# Altium project rp3a0_mini.PrjPcb
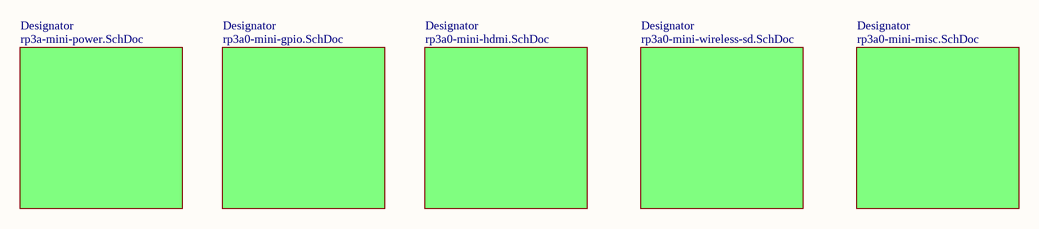
[diagram p0: rp3a0-mini-main.SchDoc]
6 sheets, 124 parts. Net scope: global (net labels, ports and power ports of the same name join across sheets).
Board file: rp3a0-mini.PcbDoc
Sheets:
  rp3a0-mini-main.SchDoc
    Designator = rp3a-mini-power.SchDoc
    Designator = rp3a0-mini-gpio.SchDoc
    Designator = rp3a0-mini-hdmi.SchDoc
    Designator = rp3a0-mini-wireless-sd.SchDoc
    Designator = rp3a0-mini-misc.SchDoc

## Sheet rp3a0-mini-main.SchDoc
size A4; SheetNumber: 1; SheetTotal: 6

### Sub-sheets
Designator = rp3a-mini-power.SchDoc: no entries
Designator = rp3a0-mini-gpio.SchDoc: no entries
Designator = rp3a0-mini-hdmi.SchDoc: no entries
Designator = rp3a0-mini-wireless-sd.SchDoc: no entries
Designator = rp3a0-mini-misc.SchDoc: no entries

## Sheet rp3a-mini-power.SchDoc
size A4; SheetNumber: 2; SheetTotal: 6
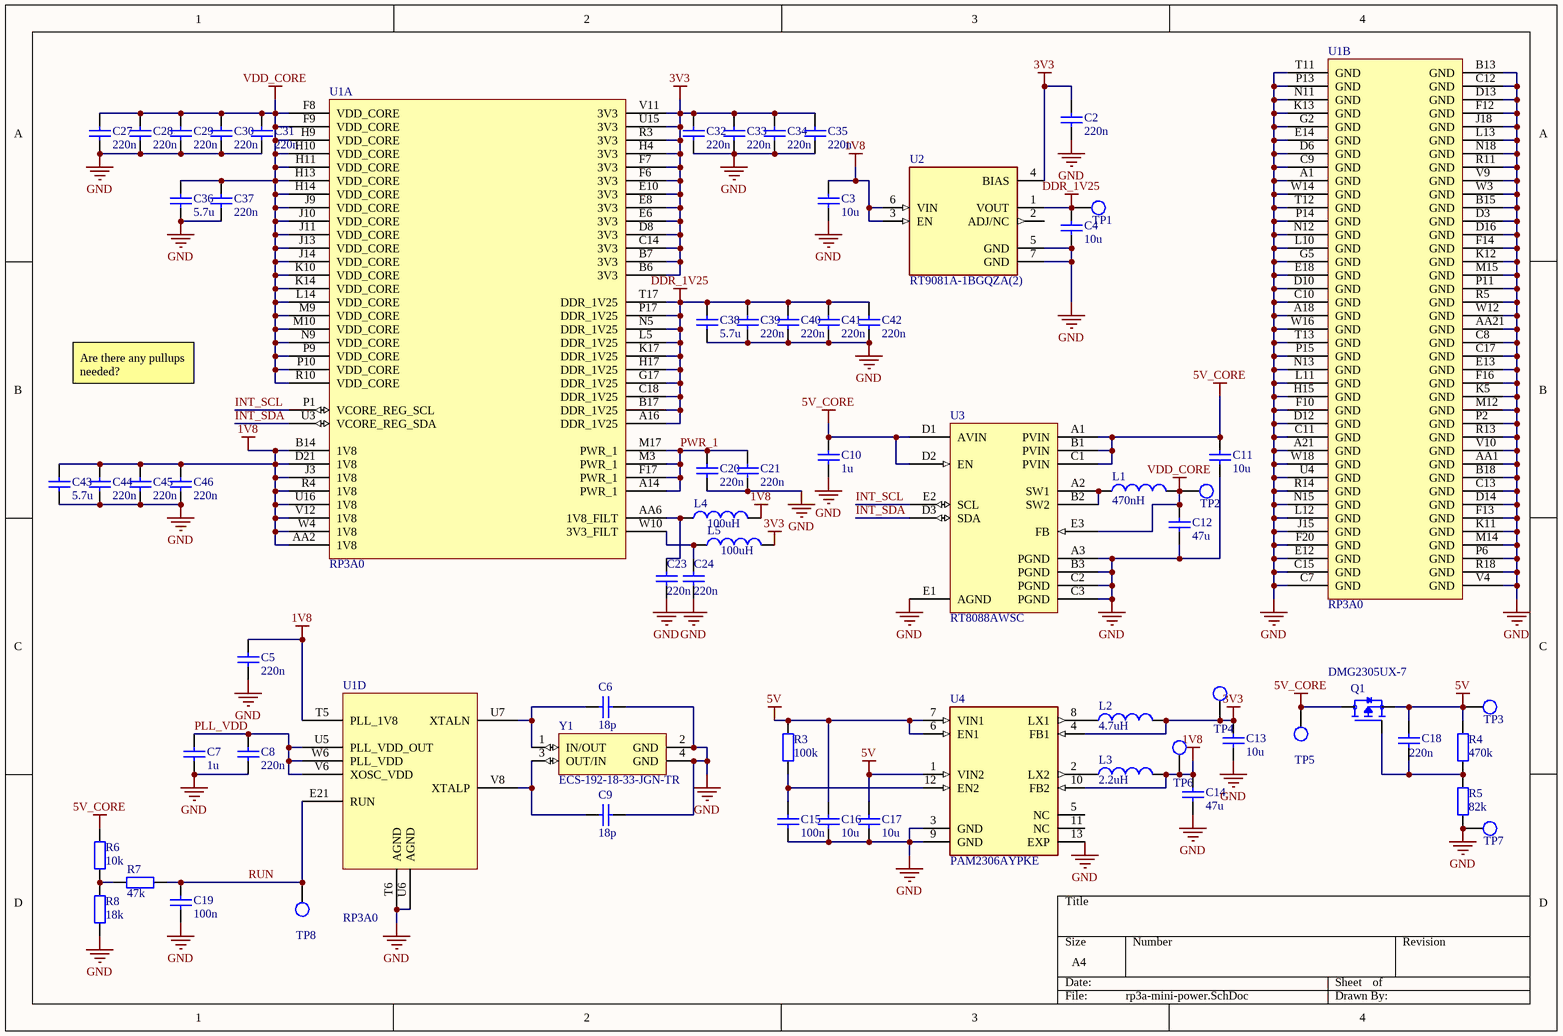
[diagram p1: rp3a-mini-power.SchDoc]

### Parts
C2  value 220n  [0402]  (hidden comment: Cap)
C3  value 10u  [0603]  (hidden comment: Cap)
C4  value 10u  [0603]  (hidden comment: Cap)
C5  value 220n  [0402]  (hidden comment: Cap)
C6  value 18p  [0402]  (hidden comment: Cap)
C7  value 1u  [0402]  (hidden comment: Cap)
C8  value 220n  [0402]  (hidden comment: Cap)
C9  value 18p  [0402]  (hidden comment: Cap)
C10  value 1u  [0402]  (hidden comment: Cap)
C11  value 10u  [0603]  (hidden comment: Cap)
C12  value 47u  [C0805 NP]  (hidden comment: Cap)
C13  value 10u  [0603]  (hidden comment: Cap)
C14  value 47u  [C0805 NP]  (hidden comment: Cap)
C15  value 100n  [0402]  (hidden comment: Cap)
C16  value 10u  [0603]  (hidden comment: Cap)
C17  value 10u  [0603]  (hidden comment: Cap)
C18  value 220n  [0402]  (hidden comment: Cap)
C19  value 100n  [0402]  (hidden comment: Cap)
C20  value 220n  [0402]  (hidden comment: Cap)
C21  value 220n  [0402]  (hidden comment: Cap)
C23  value 220n  [0402]  (hidden comment: Cap)
C24  value 220n  [0402]  (hidden comment: Cap)
C27  value 220n  [0402]  (hidden comment: Cap)
C28  value 220n  [0402]  (hidden comment: Cap)
C29  value 220n  [0402]  (hidden comment: Cap)
C30  value 220n  [0402]  (hidden comment: Cap)
C31  value 220n  [0402]  (hidden comment: Cap)
C32  value 220n  [0402]  (hidden comment: Cap)
C33  value 220n  [0402]  (hidden comment: Cap)
C34  value 220n  [0402]  (hidden comment: Cap)
C35  value 220n  [0402]  (hidden comment: Cap)
C36  value 5.7u  [0603]  (hidden comment: Cap)
C37  value 220n  [0402]  (hidden comment: Cap)
C38  value 5.7u  [0603]  (hidden comment: Cap)
C39  value 220n  [0402]  (hidden comment: Cap)
C40  value 220n  [0402]  (hidden comment: Cap)
C41  value 220n  [0402]  (hidden comment: Cap)
C42  value 220n  [0402]  (hidden comment: Cap)
C43  value 5.7u  [0603]  (hidden comment: Cap)
C44  value 220n  [0402]  (hidden comment: Cap)
C45  value 220n  [0402]  (hidden comment: Cap)
C46  value 220n  [0402]  (hidden comment: Cap)
L1  value 470nH  [INDC2016X100N]  (hidden comment: INDUCTOR)
L2  value 4.7uH  [INDP4040X180N]  (hidden comment: INDUCTOR)
L3  value 2.2uH  [INDP2622X120N]  (hidden comment: INDUCTOR)
L4  value 100uH  [0402]  (hidden comment: INDUCTOR)
L5  value 100uH  [0402]  (hidden comment: INDUCTOR)
Q1  DMG2305UX-7  [SOT91P240X110-3N_DMG2305UX-7]
R3  value 100k  [RES-0402-SML]  (hidden comment: Res SMD)
R4  value 470k  [RES-0402-SML]  (hidden comment: Res SMD)
R5  value 82k  [RES-0402-SML]  (hidden comment: Res SMD)
R6  value 10k  [RES-0402-SML]  (hidden comment: Res SMD)
R7  value 47k  [RES-0402-SML]  (hidden comment: Res SMD)
R8  value 18k  [RES-0402-SML]  (hidden comment: Res SMD)
TP1  TEST_POINT  [TEST_POINT_1.2MM]  (value not drawn)
TP2  TEST_POINT  [TEST_POINT_1.2MM]  (value not drawn)
TP3  TEST_POINT  [TEST_POINT_1.2MM]  (value not drawn)
TP4  TEST_POINT  [TEST_POINT_1.2MM]  (value not drawn)
TP5  TEST_POINT  [TEST_POINT_1.2MM]  (value not drawn)
TP6  TEST_POINT  [TEST_POINT_1.2MM]  (value not drawn)
TP7  TEST_POINT  [TEST_POINT_1.2MM]  (value not drawn)
TP8  TEST_POINT  [TEST_POINT_1.2MM]  (value not drawn)
U1  RP3A0  [RP3A0-BGA]  (parts A,B,D of 8)
U2  RT9081A-1BGQZA(2)  [VREG_RT9081A_1BGQZA(2)]
U3  RT8088AWSC  [15B_WLCSP_1.31x2.11]
U4  PAM2306AYPKE  [SON45P300X300X80-13N]
Y1  ECS-192-18-33-JGN-TR  [XTAL_ECS-192-18-33-JGN-TR]

### Nets
1V8: C3.2 C5.2 C14.2 C43.2 C44.2 C45.2 C46.2 L3.2 L4.2 TP6.TP U1.AA2(1V8) U1.B14(1V8) U1.D21(1V8) U1.J3(1V8) U1.R4(1V8) U1.T5(PLL_1V8) U1.U16(1V8) U1.V12(1V8) U1.W4(1V8) U2.3(EN) U2.6(VIN) U4.10(FB2)
3V3: C2.2 C13.2 C32.2 C33.2 C34.2 C35.2 L2.2 L5.2 TP4.TP U1.B6(3V3) U1.B7(3V3) U1.C14(3V3) U1.D8(3V3) U1.E6(3V3) U1.E8(3V3) U1.E10(3V3) U1.F6(3V3) U1.F7(3V3) U1.H4(3V3) U1.R3(3V3) U1.U15(3V3) U1.V11(3V3) U2.4(BIAS) U4.4(FB1)
5V: C16.2 C17.2 C18.2 Q1.2(S) R3.2 R4.2 TP3.TP U4.1(VIN2) U4.6(EN1) U4.7(VIN1)
5V_CORE: C10.2 C11.2 Q1.3(D) R6.2 TP5.TP U3.A1(PVIN) U3.B1(PVIN) U3.C1(PVIN) U3.D1(AVIN) U3.D2(EN)
DDR_1V25: C4.2 C38.2 C39.2 C40.2 C41.2 C42.2 TP1.TP U1.A16(DDR_1V25) U1.B17(DDR_1V25) U1.C18(DDR_1V25) U1.G17(DDR_1V25) U1.H17(DDR_1V25) U1.K17(DDR_1V25) U1.L5(DDR_1V25) U1.N5(DDR_1V25) U1.P17(DDR_1V25) U1.T17(DDR_1V25) U2.1(VOUT)
GND: C2.1 C3.1 C4.1 C5.1 C6.2 C7.1 C8.1 C9.2 C10.1 C11.1 C12.1 C13.1 C14.1 C15.1 C16.1 C17.1 C19.1 C20.1 C21.1 C23.1 C24.1 C27.1 C28.1 C29.1 C30.1 C31.1 C32.1 C33.1 C34.1 C35.1 C36.1 C37.1 C38.1 C39.1 C40.1 C41.1 C42.1 C43.1 C44.1 C45.1 C46.1 R5.2 R8.1 TP7.TP U1.A1(GND) U1.A18(GND) U1.A21(GND) U1.AA1(GND) U1.AA21(GND) U1.B13(GND) U1.B15(GND) U1.B18(GND) U1.C7(GND) U1.C8(GND) U1.C9(GND) U1.C10(GND) U1.C11(GND) U1.C12(GND) U1.C13(GND) U1.C15(GND) U1.C17(GND) U1.D3(GND) U1.D6(GND) U1.D10(GND) U1.D12(GND) U1.D13(GND) U1.D14(GND) U1.D16(GND) U1.E12(GND) U1.E13(GND) U1.E14(GND) U1.E18(GND) U1.F10(GND) U1.F12(GND) U1.F13(GND) U1.F14(GND) U1.F16(GND) U1.F20(GND) U1.G2(GND) U1.G5(GND) U1.H15(GND) U1.J15(GND) U1.J18(GND) U1.K5(GND) U1.K11(GND) U1.K12(GND) U1.K13(GND) U1.L10(GND) U1.L11(GND) U1.L12(GND) U1.L13(GND) U1.M12(GND) U1.M14(GND) U1.M15(GND) U1.N11(GND) U1.N12(GND) U1.N13(GND) U1.N15(GND) U1.N18(GND) U1.P2(GND) U1.P6(GND) U1.P11(GND) U1.P13(GND) U1.P14(GND) U1.P15(GND) U1.R5(GND) U1.R11(GND) U1.R13(GND) U1.R14(GND) U1.R18(GND) U1.T6(AGND) U1.T11(GND) U1.T12(GND) U1.T13(GND) U1.U4(GND) U1.U6(AGND) U1.V4(GND) U1.V9(GND) U1.V10(GND) U1.W3(GND) U1.W12(GND) U1.W14(GND) U1.W16(GND) U1.W18(GND) U2.5(GND) U2.7(GND) U3.A3(PGND) U3.B3(PGND) U3.C2(PGND) U3.C3(PGND) U3.E1(AGND) U4.3(GND) U4.9(GND) U4.13(EXP) Y1.2(GND) Y1.4(GND)
VDD_CORE: C12.2 C27.2 C28.2 C29.2 C30.2 C31.2 C36.2 C37.2 L1.2 TP2.TP U1.F8(VDD_CORE) U1.F9(VDD_CORE) U1.H9(VDD_CORE) U1.H10(VDD_CORE) U1.H11(VDD_CORE) U1.H13(VDD_CORE) U1.H14(VDD_CORE) U1.J9(VDD_CORE) U1.J10(VDD_CORE) U1.J11(VDD_CORE) U1.J13(VDD_CORE) U1.J14(VDD_CORE) U1.K10(VDD_CORE) U1.K14(VDD_CORE) U1.L14(VDD_CORE) U1.M9(VDD_CORE) U1.M10(VDD_CORE) U1.N9(VDD_CORE) U1.P9(VDD_CORE) U1.P10(VDD_CORE) U1.R10(VDD_CORE) U3.E3(FB)
INT_SCL: U1.P1(VCORE_REG_SCL) U3.E2(SCL)
INT_SDA: U1.U3(VCORE_REG_SDA) U3.D3(SDA)
PLL_VDD: C7.2 C8.2 U1.U5(PLL_VDD_OUT) U1.V6(XOSC_VDD) U1.W6(PLL_VDD)
PWR_1: C20.2 C21.2 U1.A14(PWR_1) U1.F17(PWR_1) U1.M3(PWR_1) U1.M17(PWR_1)
RUN: C19.2 R7.2 TP8.TP U1.E21(RUN)
NetC6_1: C6.1 U1.U7(XTALN) Y1.1(IN/OUT)
NetC9_1: C9.1 U1.V8(XTALP) Y1.3(OUT/IN)
NetC15_2: C15.2 R3.1 U4.12(EN2)
NetC18_1: C18.1 Q1.1(G) R4.1 R5.1
NetC23_2: C23.2 L4.1 U1.AA6(1V8_FILT)
NetC24_2: C24.2 L5.1 U1.W10(3V3_FILT)
NetL1_1: L1.1 U3.A2(SW1) U3.B2(SW2)
NetL2_1: L2.1 U4.8(LX1)
NetL3_1: L3.1 U4.2(LX2)
NetR6_1: R6.1 R7.1 R8.2

Not connected (* = marked no-connect by the designer): U2 2(ADJ/NC); U4 5(NC) 11(NC)

### Notes on the sheet
- Are there any pullups needed?

### Library data of the parts
C2-C21 C23 C24 C27-C46 = CAP-NONPOL: Capacitor
L1-L5 = INDUCTOR: Inductor SMD
Q1 = DMG2305UX-7: P-Channel 20V 4.2A _Ta_ 1.4W _Ta_ Surface Mount SOT-23; MF: Power Analog Micro; SnapEDA_Link: https://www.snapeda.com/parts/DMG2305UX-7/Power%20Analog%20Micro/view-part/174848/?ref=snap; Price: None; MP: DMG2305UX-7; Package: TO-236-3 Power Analog Micro; Value: *; Availability: Unavailable
R3-R8 = Res SMD: Resistor
TP1-TP8 = TEST_POINT: Test point
U2 = RT9081A-1BGQZA(2): Linear Voltage Regulator IC 1 Output 500mA 6-ZADFN (1.2x1.2); MP: RT9081AGQZA; MF: Richtek USA; Value: *; Package: XFDFN-6 Richtek; Availability: In Stock; Check_prices: https://www.snapeda.com/parts/RT9081AGQZA/Richtek+USA+Inc./view-part/?ref=eda; SnapEDA_Link: https://www.snapeda.com/parts/RT9081AGQZA/Richtek+USA+Inc./view-part/?ref=snap; Price: None
U3 = RT8088AWSC: Buck Switching Regulator IC Positive Programmable 0.6V 1 Output 3A 15-UFBGA, WLCSP
U4 = PAM2306AYPKE: Buck Switching Regulator IC Positive Fixed 1.8V, 3.3V 2 Output 1A 12-WFDFN Exposed Pad; MF: Diodes Inc.; Value: *; MP: PAM2306AYPKE; Package: WFDFN-12 Diodes Inc.; Price: None; SnapEDA_Link: https://www.snapeda.com/parts/PAM2306AYPKE/Diodes%20Inc./view-part/481908/?ref=snap; Availability: Unavailable
Y1 = ECS-192-18-33-JGN-TR: The sub miniature ECX-32 is a compact SMD Crystal. The 3.2 x 2.5 x 0.8 mm ceramic package is ideal for todayâ€™s SMD manufacturing environment.; Package: None; Price: None; Value: *; MP: ECS-192-18-33-JGN-TR; Availability: Unavailable

## Sheet rp3a0-mini-gpio.SchDoc
size A4; SheetNumber: 3; SheetTotal: 6
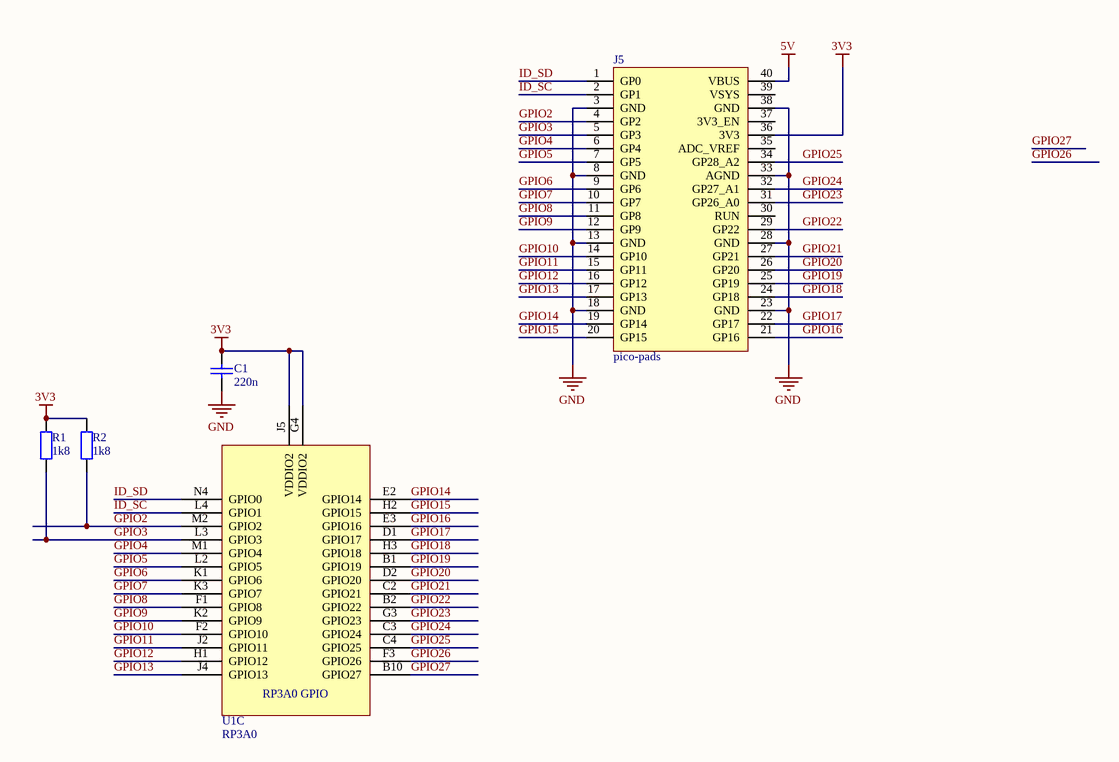
[diagram p2: rp3a0-mini-gpio.SchDoc]

### Parts
C1  value 220n  [0402]  (hidden comment: Cap)
J5  pico-pads  [PICO_PADS]
R1  value 1k8  [RES-0402-SML]  (hidden comment: Res SMD)
R2  value 1k8  [RES-0402-SML]  (hidden comment: Res SMD)
U1  RP3A0  [RP3A0-BGA]  (part C of 8)

### Nets
3V3: C1.2 J5.36(3V3) R1.2 R2.2 U1.G4(VDDIO2) U1.J5(VDDIO2)
5V: J5.40(VBUS)
GND: C1.1 J5.3(GND) J5.8(GND) J5.13(GND) J5.18(GND) J5.23(GND) J5.28(GND) J5.33(AGND) J5.38(GND)
GPIO2: J5.4(GP2) R2.1 U1.M2(GPIO2)
GPIO3: J5.5(GP3) R1.1 U1.L3(GPIO3)
GPIO4: J5.6(GP4) U1.M1(GPIO4)
GPIO5: J5.7(GP5) U1.L2(GPIO5)
GPIO6: J5.9(GP6) U1.K1(GPIO6)
GPIO7: J5.10(GP7) U1.K3(GPIO7)
GPIO8: J5.11(GP8) U1.F1(GPIO8)
GPIO9: J5.12(GP9) U1.K2(GPIO9)
GPIO10: J5.14(GP10) U1.F2(GPIO10)
GPIO11: J5.15(GP11) U1.J2(GPIO11)
GPIO12: J5.16(GP12) U1.H1(GPIO12)
GPIO13: J5.17(GP13) U1.J4(GPIO13)
GPIO14: J5.19(GP14) U1.E2(GPIO14)
GPIO15: J5.20(GP15) U1.H2(GPIO15)
GPIO16: J5.21(GP16) U1.E3(GPIO16)
GPIO17: J5.22(GP17) U1.D1(GPIO17)
GPIO18: J5.24(GP18) U1.H3(GPIO18)
GPIO19: J5.25(GP19) U1.B1(GPIO19)
GPIO20: J5.26(GP20) U1.D2(GPIO20)
GPIO21: J5.27(GP21) U1.C2(GPIO21)
GPIO22: J5.29(GP22) U1.B2(GPIO22)
GPIO23: J5.31(GP26_A0) U1.G3(GPIO23)
GPIO24: J5.32(GP27_A1) U1.C3(GPIO24)
GPIO25: J5.34(GP28_A2) U1.C4(GPIO25)
GPIO26: U1.F3(GPIO26)
GPIO27: U1.B10(GPIO27)
ID_SC: J5.2(GP1) U1.L4(GPIO1)
ID_SD: J5.1(GP0) U1.N4(GPIO0)

Not connected (* = marked no-connect by the designer): J5 30(RUN) 35(ADC_VREF) 37(3V3_EN) 39(VSYS)

### Notes on the sheet
- (in symbol RP3A0, part C) RP3A0 GPIO

### Library data of the parts
C1 = CAP-NONPOL: Capacitor
R1 R2 = Res SMD: Resistor

## Sheet rp3a0-mini-hdmi.SchDoc
size A4; SheetNumber: 4; SheetTotal: 6
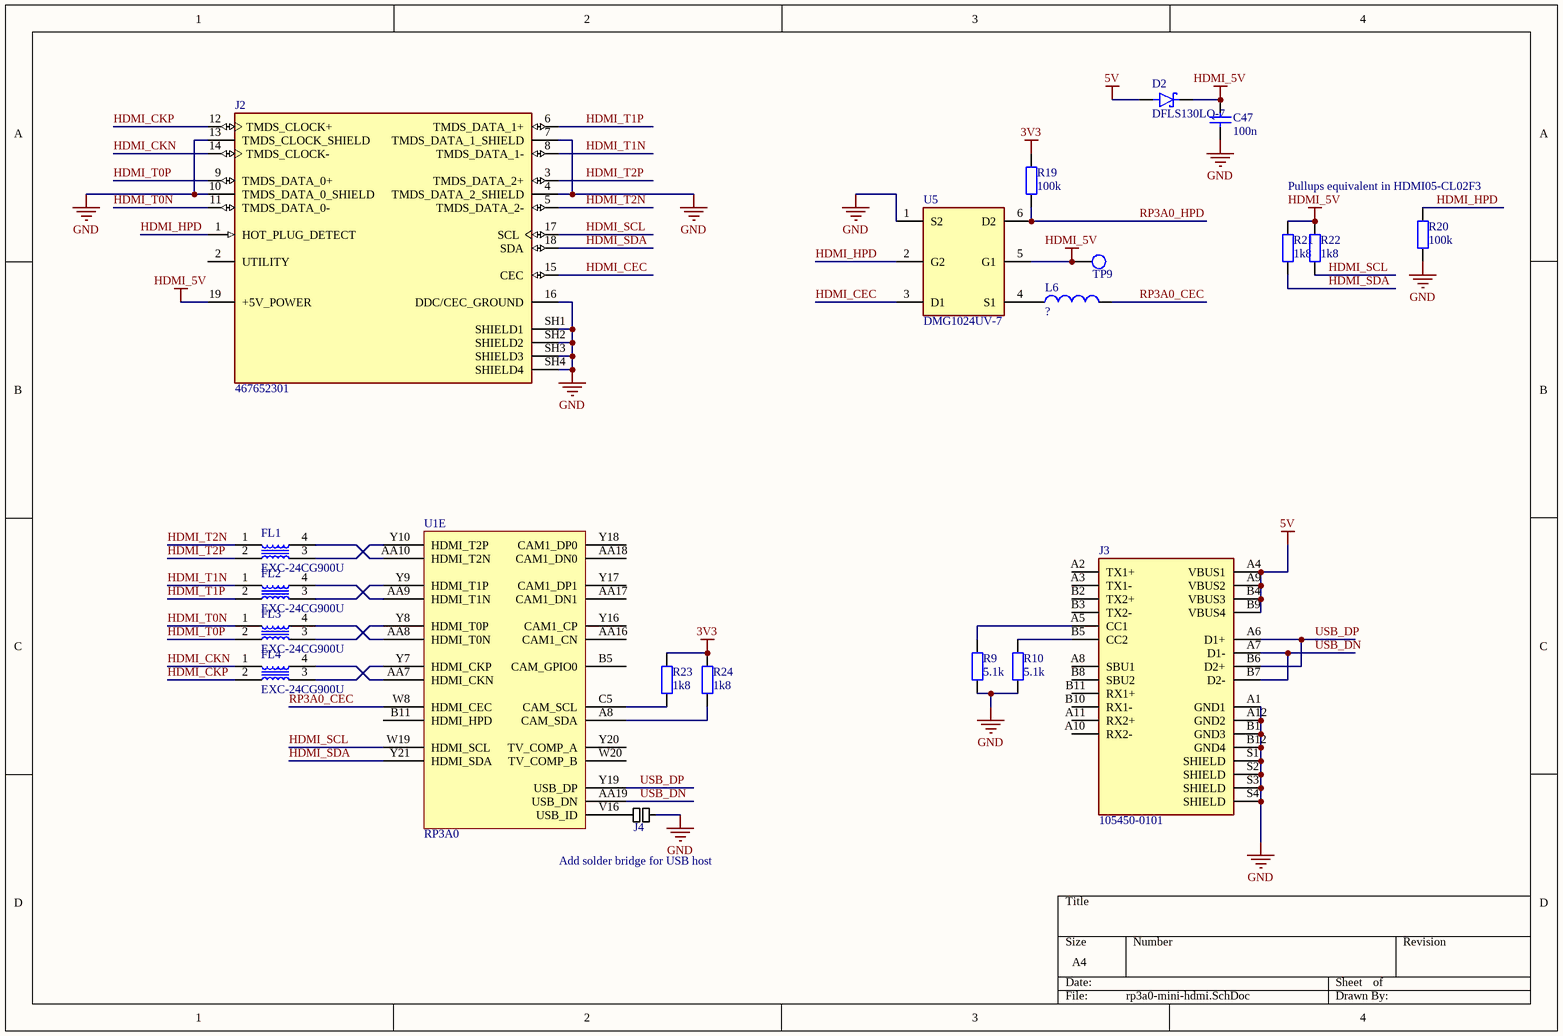
[diagram p3: rp3a0-mini-hdmi.SchDoc]

### Parts
C47  value 100n  [0402]  (hidden comment: Cap)
D2  DFLS130LQ-7  [DIO_DFLS130LQ-7]
FL1  EXC-24CG900U  [FIL_EXC24CB102U]
FL2  EXC-24CG900U  [FIL_EXC24CB102U]
FL3  EXC-24CG900U  [FIL_EXC24CB102U]
FL4  EXC-24CG900U  [FIL_EXC24CB102U]
J2  467652301  [MOLEX_467652301]
J3  105450-0101  [MOLEX_105450-0101]
J4  SOLDER_PAD_OPEN  [SOLDER_PAD_OPEN]  (value not drawn)  (net tie, no BOM)
L6  INDUCTOR  [0402]  (value not drawn)
R9  value 5.1k  [RES-0402-SML]  (hidden comment: Res SMD)
R10  value 5.1k  [RES-0402-SML]  (hidden comment: Res SMD)
R19  value 100k  [RES-0402-SML]  (hidden comment: Res SMD)
R20  value 100k  [RES-0402-SML]  (hidden comment: Res SMD)
R21  value 1k8  [RES-0402-SML]  (hidden comment: Res SMD)
R22  value 1k8  [RES-0402-SML]  (hidden comment: Res SMD)
R23  value 1k8  [RES-0402-SML]  (hidden comment: Res SMD)
R24  value 1k8  [RES-0402-SML]  (hidden comment: Res SMD)
TP9  TEST_POINT  [TEST_POINT_1.2MM]  (value not drawn)
U1  RP3A0  [RP3A0-BGA]  (part E of 8)
U5  DMG1024UV-7  [SOT50P162X60-6N]

### Nets
3V3: R19.2 R23.2 R24.2
5V: D2.A J3.A4(VBUS1) J3.A9(VBUS2) J3.B4(VBUS3) J3.B9(VBUS4)
GND: C47.1 J2.4(TMDS_DATA_2_SHIELD) J2.7(TMDS_DATA_1_SHIELD) J2.10(TMDS_DATA_0_SHIELD) J2.13(TMDS_CLOCK_SHIELD) J2.16(DDC/CEC_GROUND) J2.SH1(SHIELD1) J2.SH2(SHIELD2) J2.SH3(SHIELD3) J2.SH4(SHIELD4) J3.A1(GND1) J3.A12(GND2) J3.B1(GND3) J3.B12(GND4) J3.S1(SHIELD) J3.S2(SHIELD) J3.S3(SHIELD) J3.S4(SHIELD) J4.2 R9.1 R10.1 R20.1 U5.1(S2)
HDMI_5V: C47.2 D2.K J2.19(+5V_POWER) R21.2 R22.2 TP9.TP U5.5(G1)
HDMI_CEC: J2.15(CEC) U5.3(D1)
HDMI_CKN: FL4.1 J2.14(TMDS_CLOCK-)
HDMI_CKP: FL4.2 J2.12(TMDS_CLOCK+)
HDMI_HPD: J2.1(HOT_PLUG_DETECT) R20.2 U5.2(G2)
HDMI_SCL: J2.17(SCL) R22.1 U1.W19(HDMI_SCL)
HDMI_SDA: J2.18(SDA) R21.1 U1.Y21(HDMI_SDA)
HDMI_T0N: FL3.1 J2.11(TMDS_DATA_0-)
HDMI_T0P: FL3.2 J2.9(TMDS_DATA_0+)
HDMI_T1N: FL2.1 J2.8(TMDS_DATA_1-)
HDMI_T1P: FL2.2 J2.6(TMDS_DATA_1+)
HDMI_T2N: FL1.1 J2.5(TMDS_DATA_2-)
HDMI_T2P: FL1.2 J2.3(TMDS_DATA_2+)
RP3A0_CEC: L6.2 U1.W8(HDMI_CEC)
RP3A0_HPD: R19.1 U5.6(D2)
USB_DN: J3.A7(D1-) J3.B7(D2-) U1.AA19(USB_DN)
USB_DP: J3.A6(D1+) J3.B6(D2+) U1.Y19(USB_DP)
NetFL1_3: FL1.3 U1.Y10(HDMI_T2P)
NetFL1_4: FL1.4 U1.AA10(HDMI_T2N)
NetFL2_3: FL2.3 U1.Y9(HDMI_T1P)
NetFL2_4: FL2.4 U1.AA9(HDMI_T1N)
NetFL3_3: FL3.3 U1.Y8(HDMI_T0P)
NetFL3_4: FL3.4 U1.AA8(HDMI_T0N)
NetFL4_3: FL4.3 U1.Y7(HDMI_CKP)
NetFL4_4: FL4.4 U1.AA7(HDMI_CKN)
NetJ3_A5: J3.A5(CC1) R9.2
NetJ3_B5: J3.B5(CC2) R10.2
NetJ4_1: J4.1 U1.V16(USB_ID)
NetL6_1: L6.1 U5.4(S1)
NetR23_1: R23.1 U1.C5(CAM_SCL)
NetR24_1: R24.1 U1.A8(CAM_SDA)

Not connected (* = marked no-connect by the designer): J2 2(UTILITY); J3 A2(TX1+) A3(TX1-) A8(SBU1) A10(RX2-) A11(RX2+) B2(TX2+) B3(TX2-) B8(SBU2) B10(RX1-) B11(RX1+); U1 AA16(CAM1_CN) AA17(CAM1_DN1) AA18(CAM1_DN0) B5(CAM_GPIO0) B11(HDMI_HPD) W20(TV_COMP_B) Y16(CAM1_CP) Y17(CAM1_DP1) Y18(CAM1_DP0) Y20(TV_COMP_A)

### Notes on the sheet
- Pullups equivalent in HDMI05-CL02F3
- Add solder bridge for USB host

### Library data of the parts
C47 = CAP-NONPOL: Capacitor
D2 = DFLS130LQ-7: Diode Schottky 1A 30V PowerDI 123 ¦ Diodes Inc DFLS130LQ-7; MF: Diodes Inc.; MP: DFLS1100-7; SnapEDA_Link: https://www.snapeda.com/parts/DFLS1100-7/Diodes+Inc./view-part/?ref=snap; Package: POWERDIÂ®123 Diodes Incorporated; Value: *; Check_prices: https://www.snapeda.com/parts/DFLS1100-7/Diodes+Inc./view-part/?ref=eda
FL1-FL4 = EXC-24CG900U: Series/Type: Common mode Filters(for Gbps), Size [LÃ—W] (mm): 1.25Ã—1.0, Height (mm): 0.5, Impedance [Common Mode] (â„¦): 90, Rated Voltage [DC] (V): 5, Rated Current [DC] (mA): 100, DC Resistance [max.] (â„¦): 3, Number of circuit: 1; MP: EXC24CG900U; MF: Panasonic; Package: 0504 Panasonic; Purchase-URL: https://pricing.snapeda.com/search/part/EXC24CG900U/?ref=eda; Availability: In Stock; Value: *; Price: None; Check_prices: https://www.snapeda.com/parts/EXC24CG900U/Panasonic/view-part/?ref=eda; SnapEDA_Link: https://www.snapeda.com/parts/EXC24CG900U/Panasonic/view-part/?ref=snap
J2 = 467652301: 0.40mm Pitch Micro HDMI Connector, Right-Angle Receptacle, Surface Mount, Hybrid Type Mount, with Pick-and-Place Polyimide Tape, 19 Circuits, Lead-Free; MF: Molex; SnapEDA_Link: https://www.snapeda.com/parts/467652301/Molex/view-part/?ref=snap; Package: None; Value: *; MP: 467652301; Check_prices: https://www.snapeda.com/parts/467652301/Molex/view-part/?ref=eda
J3 = 105450-0101: USB-C, USB 3.1 Gen 2, Receptacle Connector 24 Position Surface Mount, Right Angle; Through Hole; MF: Molex; MP: 1054500101; Package: None; Digi-Key_Part_Number: WM12856CT-ND; SnapEDA_Link: https://www.snapeda.com/parts/1054500101/Molex/view-part/448528/?ref=snap; Digi-Key_Purchase_URL: https://www.digikey.tw/product-detail/en/molex/1054500101/WM12856CT-ND/5843891?utm_source=snapeda&utm_medium=aggregator&utm_campaign=symbol; Value: *
J4 = SOLDER_PAD_OPEN: Solder pads with no connection
L6 = INDUCTOR: Inductor SMD; Value: ?
R9 R10 R19-R24 = Res SMD: Resistor
TP9 = TEST_POINT: Test point
U5 = DMG1024UV-7: Dual N-Ch Enhancement MOSFET SOT-563 | Diodes Inc DMG1024UV-7; MF: Diodes Inc.; SnapEDA_Link: https://www.snapeda.com/parts/DMG1024UV-7/Diodes+Inc./view-part/?ref=snap; Package: SOT-563 Diodes Inc.; Value: *; MP: DMG1024UV-7; Check_prices: https://www.snapeda.com/parts/DMG1024UV-7/Diodes+Inc./view-part/?ref=eda

## Sheet rp3a0-mini-wireless-sd.SchDoc
size A4; SheetNumber: 5; SheetTotal: 6
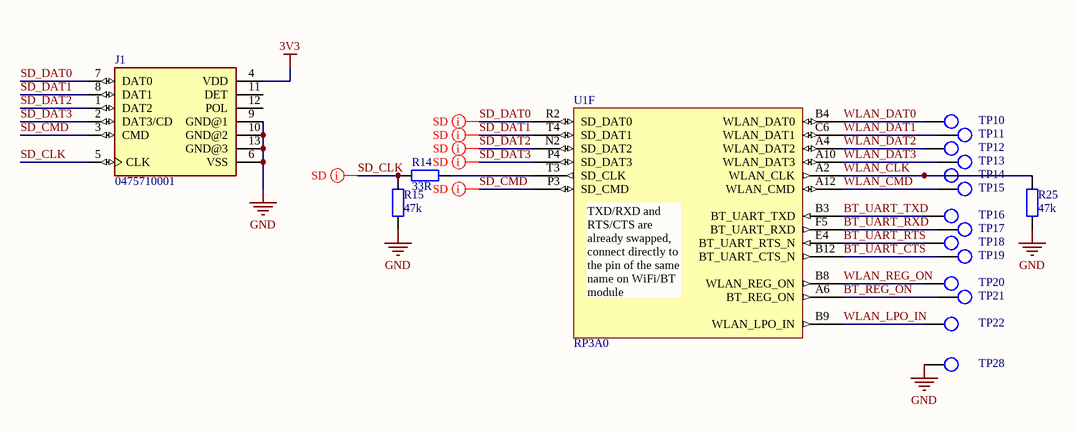
[diagram p4: rp3a0-mini-wireless-sd.SchDoc]

### Parts
J1  0475710001  [MOLEX_0475710001]
R14  value 33R  [RES-0402-SML]  (hidden comment: Res SMD)
R15  value 47k  [RES-0402-SML]  (hidden comment: Res SMD)
R25  value 47k  [RES-0402-SML]  (hidden comment: Res SMD)
TP10  TEST_POINT  [TEST_POINT_1.2MM]  (value not drawn)
TP11  TEST_POINT  [TEST_POINT_1.2MM]  (value not drawn)
TP12  TEST_POINT  [TEST_POINT_1.2MM]  (value not drawn)
TP13  TEST_POINT  [TEST_POINT_1.2MM]  (value not drawn)
TP14  TEST_POINT  [TEST_POINT_1.2MM]  (value not drawn)
TP15  TEST_POINT  [TEST_POINT_1.2MM]  (value not drawn)
TP16  TEST_POINT  [TEST_POINT_1.2MM]  (value not drawn)
TP17  TEST_POINT  [TEST_POINT_1.2MM]  (value not drawn)
TP18  TEST_POINT  [TEST_POINT_1.2MM]  (value not drawn)
TP19  TEST_POINT  [TEST_POINT_1.2MM]  (value not drawn)
TP20  TEST_POINT  [TEST_POINT_1.2MM]  (value not drawn)
TP21  TEST_POINT  [TEST_POINT_1.2MM]  (value not drawn)
TP22  TEST_POINT  [TEST_POINT_1.2MM]  (value not drawn)
TP28  TEST_POINT  [TEST_POINT_1.2MM]  (value not drawn)
U1  RP3A0  [RP3A0-BGA]  (part F of 8)

### Nets
3V3: J1.4(VDD)
GND: J1.6(VSS) J1.9(GND@1) J1.10(GND@2) J1.13(GND@3) R15.1 R25.1 TP28.TP
BT_REG_ON: TP21.TP U1.A6(BT_REG_ON)
BT_UART_CTS: TP19.TP U1.B12(BT_UART_CTS_N)
BT_UART_RTS: TP18.TP U1.E4(BT_UART_RTS_N)
BT_UART_RXD: TP17.TP U1.F5(BT_UART_RXD)
BT_UART_TXD: TP16.TP U1.B3(BT_UART_TXD)
SD_CLK: J1.5(CLK) R14.1 R15.2
SD_CMD: J1.3(CMD) U1.P3(SD_CMD)
SD_DAT0: J1.7(DAT0) U1.R2(SD_DAT0)
SD_DAT1: J1.8(DAT1) U1.T4(SD_DAT1)
SD_DAT2: J1.1(DAT2) U1.N2(SD_DAT2)
SD_DAT3: J1.2(DAT3/CD) U1.P4(SD_DAT3)
WLAN_CLK: R25.2 TP14.TP U1.A2(WLAN_CLK)
WLAN_CMD: TP15.TP U1.A12(WLAN_CMD)
WLAN_DAT0: TP10.TP U1.B4(WLAN_DAT0)
WLAN_DAT1: TP11.TP U1.C6(WLAN_DAT1)
WLAN_DAT2: TP12.TP U1.A4(WLAN_DAT2)
WLAN_DAT3: TP13.TP U1.A10(WLAN_DAT3)
WLAN_LPO_IN: TP22.TP U1.B9(WLAN_LPO_IN)
WLAN_REG_ON: TP20.TP U1.B8(WLAN_REG_ON)
NetR14_2: R14.2 U1.T3(SD_CLK)

Not connected (* = marked no-connect by the designer): J1 11(DET) 12(POL)

### Layout directives
mark named SD: SD_CLK, SD_CMD, SD_DAT0, SD_DAT1, SD_DAT2, SD_DAT3

### Notes on the sheet
- (in symbol RP3A0, part F) TXD/RXD and RTS/CTS are already swapped, connect directly to the pin of the same name on WiFi/BT module

### Library data of the parts
J1 = 0475710001: 9 _8 + 1_ Position Card Connector Secure Digital - microSDâ„¢ Surface Mount, Right Angle Gold; MF: Molex; MP: 0475710001; Package: None; Price: None; Value: *; SnapEDA_Link: https://www.snapeda.com/parts/0475710001/Molex/view-part/424368/?ref=snap; Availability: Unavailable
R14 R15 R25 = Res SMD: Resistor
TP10-TP22 TP28 = TEST_POINT: Test point

## Sheet rp3a0-mini-misc.SchDoc
size A4; SheetNumber: 6; SheetTotal: 6
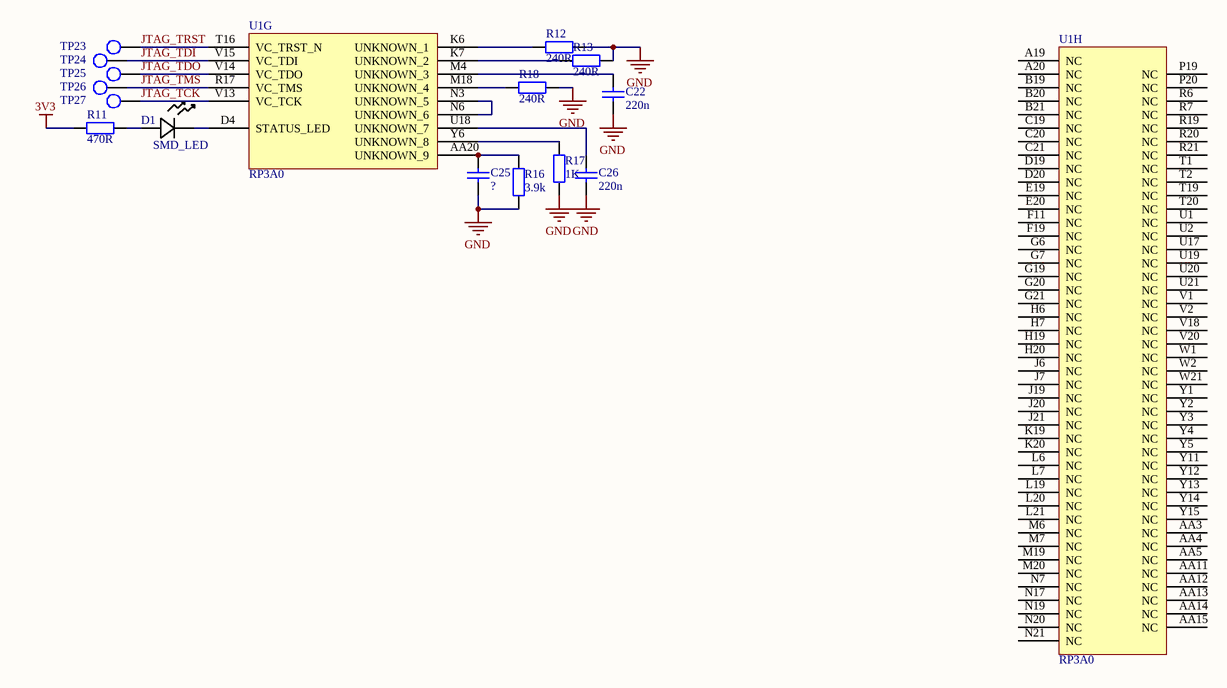
[diagram p5: rp3a0-mini-misc.SchDoc]

### Parts
C22  value 220n  [0402]  (hidden comment: Cap)
C25  Cap  [0402]  (value not drawn)
C26  value 220n  [0402]  (hidden comment: Cap)
D1  SMD_LED  [LED_0603]
R11  value 470R  [RES-0402-SML]  (hidden comment: Res SMD)
R12  value 240R  [RES-0402-SML]  (hidden comment: Res SMD)
R13  value 240R  [RES-0402-SML]  (hidden comment: Res SMD)
R16  value 3.9k  [RES-0402-SML]  (hidden comment: Res SMD)
R17  value 1K  [RES-0402-SML]  (hidden comment: Res SMD)
R18  value 240R  [RES-0402-SML]  (hidden comment: Res SMD)
TP23  TEST_POINT  [TEST_POINT_1.2MM]  (value not drawn)
TP24  TEST_POINT  [TEST_POINT_1.2MM]  (value not drawn)
TP25  TEST_POINT  [TEST_POINT_1.2MM]  (value not drawn)
TP26  TEST_POINT  [TEST_POINT_1.2MM]  (value not drawn)
TP27  TEST_POINT  [TEST_POINT_1.2MM]  (value not drawn)
U1  RP3A0  [RP3A0-BGA]  (parts G,H of 8)

### Nets
3V3: R11.1
GND: C22.1 C25.1 C26.1 R12.2 R13.2 R16.1 R17.1 R18.2
JTAG_TCK: TP27.TP U1.V13(VC_TCK)
JTAG_TDI: TP24.TP U1.V15(VC_TDI)
JTAG_TDO: TP25.TP U1.V14(VC_TDO)
JTAG_TMS: TP26.TP U1.R17(VC_TMS)
JTAG_TRST: TP23.TP U1.T16(VC_TRST_N)
NetC22_2: C22.2 U1.M4(UNKNOWN_3)
NetC25_2: C25.2 R16.2 U1.AA20(UNKNOWN_9)
NetC26_2: C26.2 U1.U18(UNKNOWN_7)
NetD1_1: D1.1 R11.2
NetD1_2: D1.2 U1.D4(STATUS_LED)
NetR12_1: R12.1 U1.K6(UNKNOWN_1)
NetR13_1: R13.1 U1.K7(UNKNOWN_2)
NetR17_2: R17.2 U1.Y6(UNKNOWN_8)
NetR18_1: R18.1 U1.M18(UNKNOWN_4)
NetU1_N3: U1.N3(UNKNOWN_5) U1.N6(UNKNOWN_6)

Not connected (* = marked no-connect by the designer): U1 A19(NC) A20(NC) AA3(NC) AA4(NC) AA5(NC) AA11(NC) AA12(NC) AA13(NC) AA14(NC) AA15(NC) B19(NC) B20(NC) B21(NC) C19(NC) C20(NC) C21(NC) D19(NC) D20(NC) E19(NC) E20(NC) F11(NC) F19(NC) G6(NC) G7(NC) G19(NC) G20(NC) G21(NC) H6(NC) H7(NC) H19(NC) H20(NC) J6(NC) J7(NC) J19(NC) J20(NC) J21(NC) K19(NC) K20(NC) L6(NC) L7(NC) L19(NC) L20(NC) L21(NC) M6(NC) M7(NC) M19(NC) M20(NC) N7(NC) N17(NC) N19(NC) N20(NC) N21(NC) P19(NC) P20(NC) R6(NC) R7(NC) R19(NC) R20(NC) R21(NC) T1(NC) T2(NC) T19(NC) T20(NC) U1(NC) U2(NC) U17(NC) U19(NC) U20(NC) U21(NC) V1(NC) V2(NC) V18(NC) V20(NC) W1(NC) W2(NC) W21(NC) Y1(NC) Y2(NC) Y3(NC) Y4(NC) Y5(NC) Y11(NC) Y12(NC) Y13(NC) Y14(NC) Y15(NC)

### Library data of the parts
C22 C25 C26 = CAP-NONPOL: Capacitor
  C25: Value: ?
R11-R13 R16-R18 = Res SMD: Resistor
TP23-TP27 = TEST_POINT: Test point

## Nets that join several sheets
3V3: rp3a-mini-power (24 pins), rp3a0-mini-gpio (6 pins), rp3a0-mini-hdmi (R19.2 R23.2 R24.2), rp3a0-mini-wireless-sd (J1.4), rp3a0-mini-misc (R11.1)
5V: rp3a-mini-power (10 pins), rp3a0-mini-gpio (J5.40), rp3a0-mini-hdmi (5 pins)
GND: rp3a-mini-power (136 pins), rp3a0-mini-gpio (9 pins), rp3a0-mini-hdmi (23 pins), rp3a0-mini-wireless-sd (7 pins), rp3a0-mini-misc (8 pins)